# EAGLE design Audio_Power_Amplifier_LM386 (EAGLE 5.11)
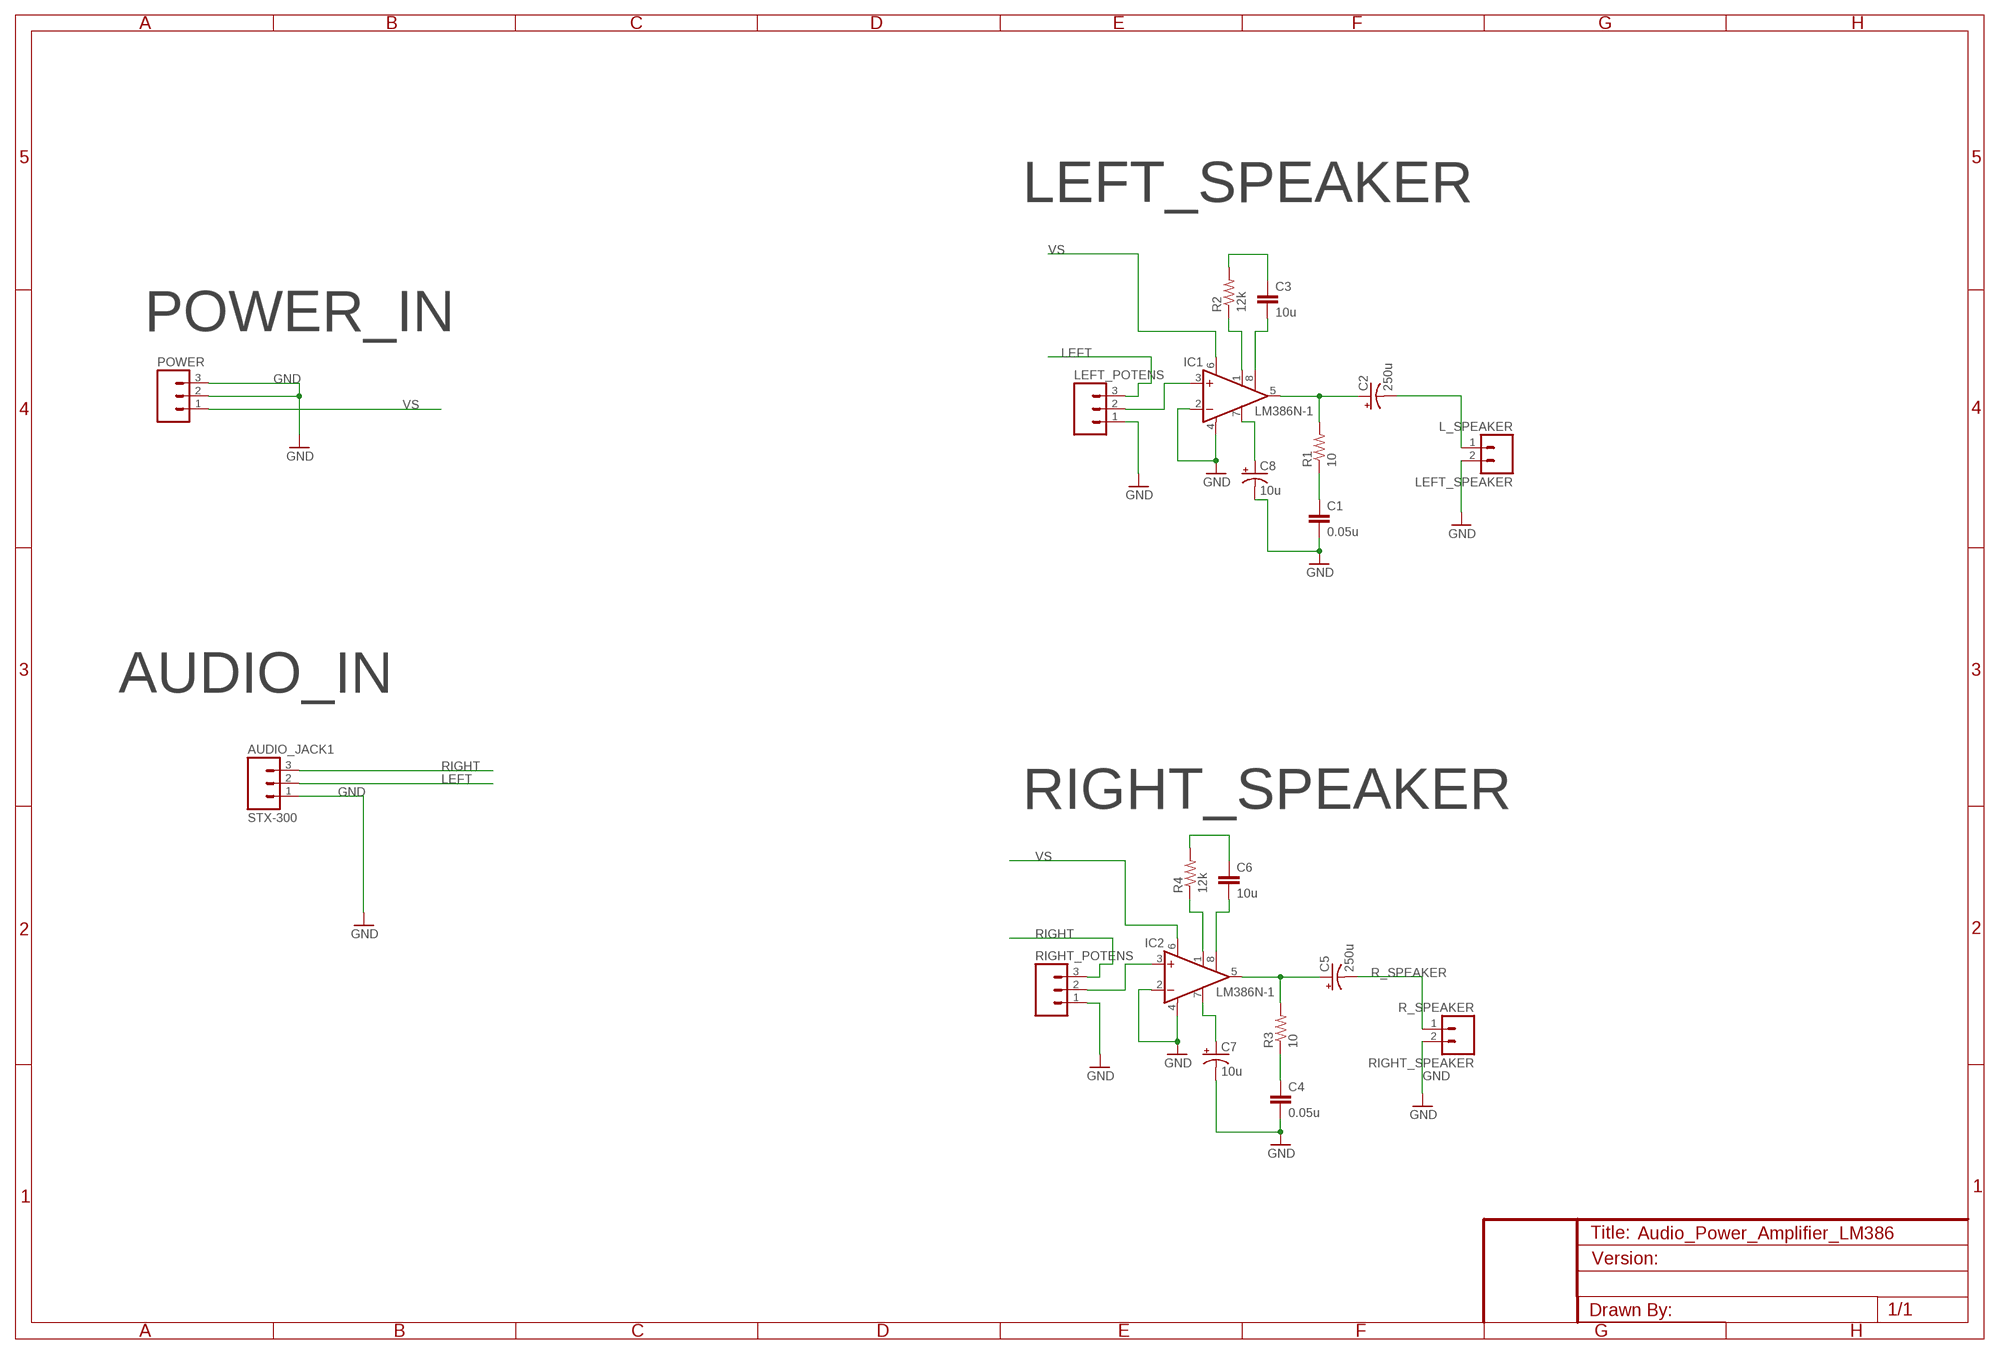
[diagram p0: schematic, sheet 1]

## Parts
AUDIO_JACK1  STX-300  M03PTH  [1X03]
C1  0.05u  CAPPTH2  [CAP-PTH-SMALL2]
C2  250u  CAP_POLPTH2  [CPOL-RADIAL-10UF-25V]
C3  10u  CAPPTH2  [CAP-PTH-SMALL2]
C4  0.05u  CAPPTH2  [CAP-PTH-SMALL2]
C5  250u  CAP_POLPTH2  [CPOL-RADIAL-10UF-25V]
C6  10u  CAPPTH2  [CAP-PTH-SMALL2]
C7  10u  CAP_POLPTH2  [CPOL-RADIAL-10UF-25V]
C8  10u  CAP_POLPTH2  [CPOL-RADIAL-10UF-25V]
IC1  LM386N-1  [DIL08]
IC2  LM386N-1  [DIL08]
LEFT_POTENS  M03PTH  [1X03]
LEFT_SPEAKER  L_SPEAKER  M02LOCK  [1X02_LOCK]
POWER  M03PTH  [1X03]
R1  10  RESISTORPTH1  [AXIAL-0.3]
R2  12k  RESISTORPTH1  [AXIAL-0.3]
R3  10  RESISTORPTH1  [AXIAL-0.3]
R4  12k  RESISTORPTH1  [AXIAL-0.3]
RIGHT_POTENS  M03PTH  [1X03]
RIGHT_SPEAKER  R_SPEAKER  M02LOCK  [1X02_LOCK]

## Nets
GND [net_GND]: AUDIO_JACK1.1 C1.2 C4.2 C7.2(-) C8.2(-) IC1.2(-IN) IC1.4(GND) IC2.2(-IN) IC2.4(GND) LEFT_POTENS.1 LEFT_SPEAKER.2 POWER.2 POWER.3 RIGHT_POTENS.1 RIGHT_SPEAKER.2
L_SPEAKER: C2.2(-) LEFT_SPEAKER.1
LEFT: AUDIO_JACK1.2 LEFT_POTENS.3
N$1: C2.1(+) IC1.5(OUT) R1.P$2
N$2: C1.1 R1.P$1
N$3: C8.1(+) IC1.7(BYPASS)
N$4: IC1.3(+IN) LEFT_POTENS.2
N$5: C7.1(+) IC2.7(BYPASS)
N$6: IC1.1(GAIN) R2.P$1
N$7: C3.1 R2.P$2
N$8: C3.2 IC1.8(GAIN)
N$9: C5.1(+) IC2.5(OUT) R3.P$2
N$10: C4.1 R3.P$1
N$12: IC2.3(+IN) RIGHT_POTENS.2
N$14: IC2.1(GAIN) R4.P$1
N$15: C6.1 R4.P$2
N$16: C6.2 IC2.8(GAIN)
R_SPEAKER: C5.2(-) RIGHT_SPEAKER.1
RIGHT: AUDIO_JACK1.3 RIGHT_POTENS.3
VS [net_VS]: IC1.6(VS) IC2.6(VS) POWER.1

## Notes on the sheet
- LEFT_SPEAKER
- POWER_IN
- AUDIO_IN
- RIGHT_SPEAKER

## Library data of the parts
AUDIO_JACK1 LEFT_POTENS POWER RIGHT_POTENS = SparkFun:M03: Header 3 Standard 3-pin 0.1" header. Use with straight break away headers (SKU : PRT-00116), right angle break away headers (PRT-00553), swiss pins (PRT-00743), machine pins (PRT-00117), and female headers (PRT-00115). Molex polarized connector foot print use with SKU : PRT-08232 with associated crimp pins and housings.
C1 C3 C4 C6 = SparkFun:CAP: Capacitor Standard 0603 ceramic capacitor, and 0.1" leaded capacitor.
C2 C5 C7 C8 = SparkFun:CAP_POL: Capacitor Polarized These are standard SMD and PTH capacitors. Normally 10uF, 47uF, and 100uF in electrolytic and tantalum varieties. Always verify the external diameter of the through hole cap, it varies with capacity, voltage, and manufacturer. The EIA devices should be standard.
IC1 IC2 = linear:LM386?-*: Low Voltage Audio Power Amplifier Source: http://cache.national.com/ds/LM/LM386.pdf
LEFT_SPEAKER RIGHT_SPEAKER = SparkFun:M02: Header 2 Standard 2-pin 0.1" header. Use with straight break away headers (SKU : PRT-00116), right angle break away headers (PRT-00553), swiss pins (PRT-00743), machine pins (PRT-00117), and female headers (PRT-00115). Molex polarized connector foot print use with SKU : PRT-08233 with associated crimp pins and housings.
R1-R4 = SparkFun:RESISTOR: Resistor Basic schematic elements and footprints for 0603, 1206, and PTH 1/10th watt (small) resistors.

## Net classes
0 net_DATA: width 0.254 mm, drill 0.254 mm, clearance 0.254 mm
1 net_GND: width 0.635 mm, drill 0.508 mm
2 net_VS: width 0.813 mm, drill 0.813 mm, clearance 0.254 mm

## Board
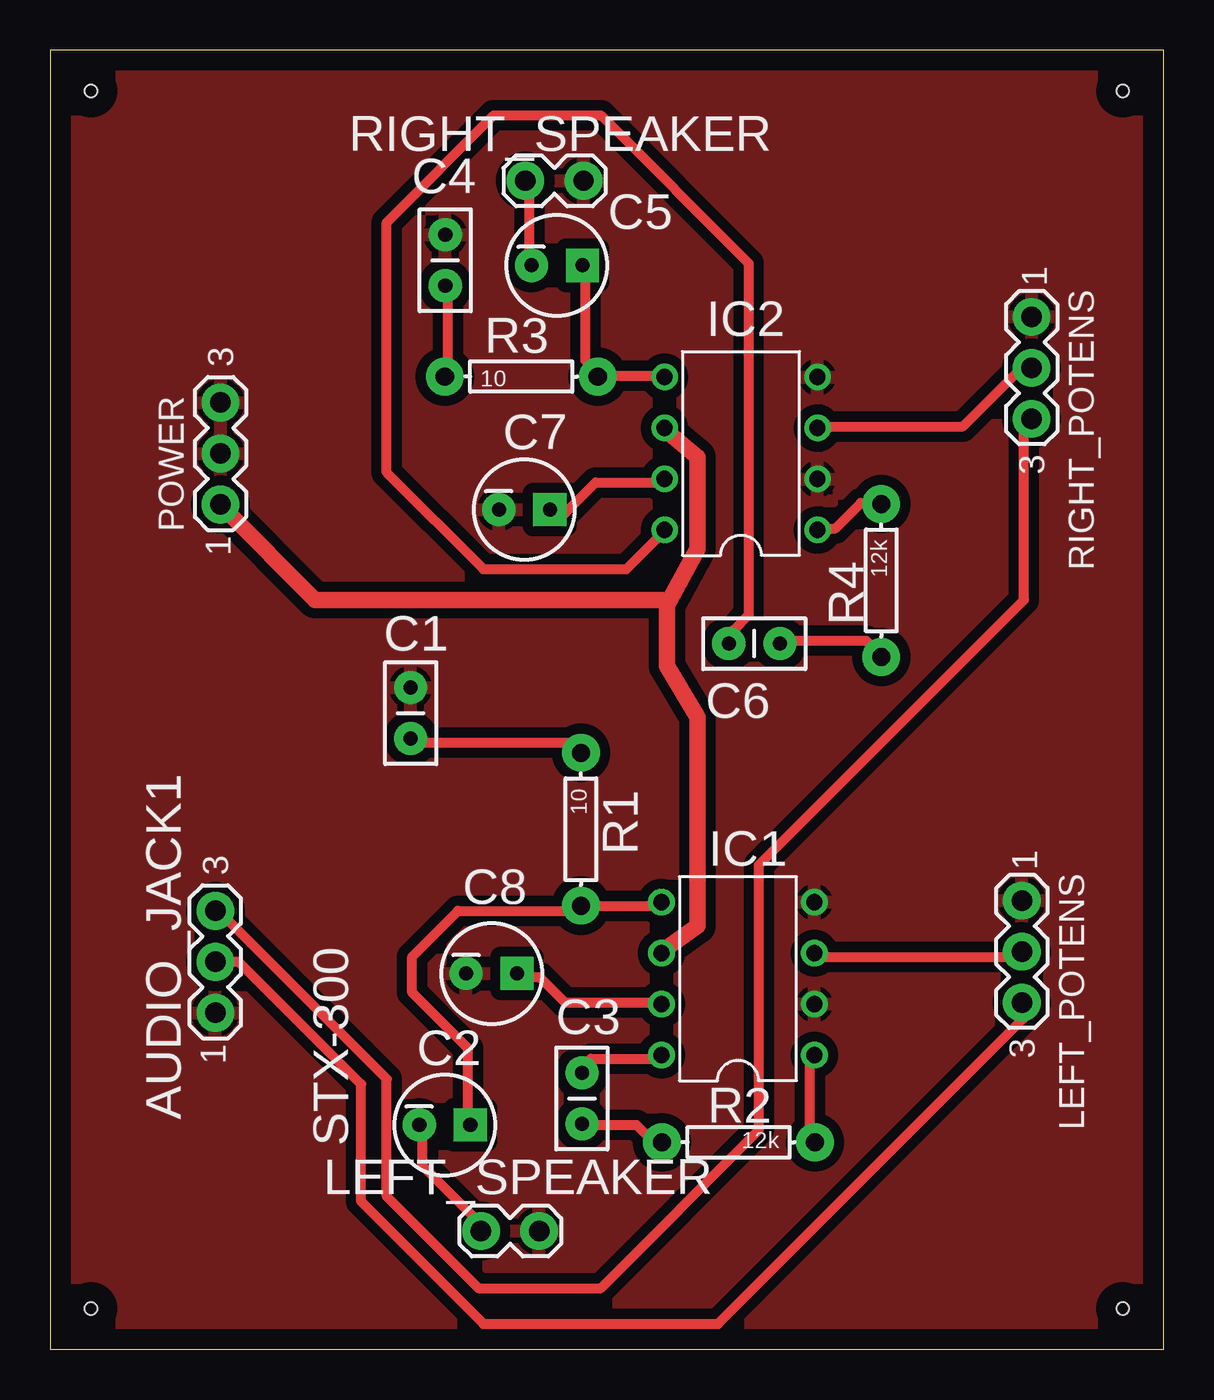
[diagram p1: board, top side]

Size 55.47 x 64.72 mm. Coordinates in mm from the lower left corner, seen from the top.
Outline: 0,0 55.47,0 55.47,64.72 0,64.72 0,0
Copper layers (1*16): Top 0.035mm / dielectric 1.5mm / Bottom 0.035mm
Design rules "my_handmade *": minimum track width 20mil, minimum drill 24mil, track to track 20mil, track to pad 20mil, pad to pad 20mil, via to via 20mil, smd to smd 20mil, copper to edge 40mil, drill to drill 8mil, minimum pad ring 10mil, minimum via ring 8mil, stop-mask expansion 4mil, vias tented up to drill 0mil, thermal gap 10mil
Holes 0.6 mm at 2.03,62.69 53.44,62.69 53.44,2.03 2.03,2.03

### Footprints (pad centres in the part's own frame; a part is rotated, then mirrored left to right if it is on the bottom)
1X03 = drill 1.016 pad 1.88 round: 1 0,0; 2 2.54,0; 3 5.08,0
CAP-PTH-SMALL2 = drill 0.7 pad 1.651 round: 1 0,0; 2 2.54,0
CPOL-RADIAL-10UF-25V = drill 0.7 pad 1.651 square: 1 1.27,0 | drill 0.7 pad 1.651 round: 2 -1.27,0
DIL08 = drill 0.813 pad 1.27 round: 1 -3.81,-3.81; 2 -1.27,-3.81; 3 1.27,-3.81; 4 3.81,-3.81; 5 3.81,3.81; 6 1.27,3.81; 7 -1.27,3.81; 8 -3.81,3.81
1X02_LOCK = drill 1.016 pad 1.88 round: 1 -0.178,0; 2 2.718,0
AXIAL-0.3 = drill 0.9 pad 1.88 round: P$1 -3.81,0; P$2 3.81,0

### Placement (x,y rotation side)
AUDIO_JACK1  8.23,16.76 90 top
C1  17.96,30.43 90 top
C2  19.66,11.18 0 top
C3  26.49,11.23 90 top
C4  19.68,52.98 90 top
C5  25.25,54 0 top
C6  36.35,35.15 180 top
C7  23.62,41.83 0 top
C8  22,18.72 0 top
IC1  34.26,18.47 90 top
IC2  34.42,44.63 90 top
LEFT_POTENS  48.41,22.35 270 top
LEFT_SPEAKER  21.64,5.89 0 top
POWER  8.48,42.09 90 top
R1  26.44,25.91 270 top
R2  34.29,10.31 180 top
R3  23.47,48.46 0 top
R4  41.4,38.3 270 top
RIGHT_POTENS  48.9,51.44 270 top
RIGHT_SPEAKER  23.85,58.22 0 top

### Tracks (layer width: path | path; a pad name or v marks a point on that pad's centre or on a via)
GND
  pour Top: 0,64.72 55.47,64.72 55.47,0 0,0
L_SPEAKER
  Top 0.508: C2.2 18.54,11.18 18.54,9.14 21.59,6.1 LEFT_SPEAKER.1
LEFT
  Top 0.508: AUDIO_JACK1.2 9.4,19.3 15.49,13.21 15.49,7.37 21.59,1.27 33.27,1.27 48.51,16.51 48.51,17.27 LEFT_POTENS.3
N$1
  Top 0.508: IC1.5 30.23,22.1 R1.P$2 26.42,22.1 26.16,21.84 20.32,21.84 18.03,19.56 18.03,17.78 20.83,14.99 20.83,11.18 C2.1
N$2
  Top 0.508: C1.1 18.03,30.23 25.91,30.23 26.42,29.72 R1.P$1
N$3
  Top 0.508: IC1.7 30.23,17.27 25.65,17.27 24.38,18.54 23.37,18.54 C8.1
N$4
  Top 0.508: IC1.3 38.1,19.56 48.01,19.56 48.26,19.81 LEFT_POTENS.2
N$5
  Top 0.508: IC2.7 30.48,43.18 27.18,43.18 25.65,41.66 24.89,41.66 C7.1
N$6
  Top 0.508: IC1.1 37.85,14.48 37.85,10.67 38.1,10.41 R2.P$1
N$7
  Top 0.508: C3.1 26.67,11.18 29.21,11.18 29.97,10.41 30.48,10.41 R2.P$2
N$8
  Top 0.508: IC1.8 30.23,14.48 26.92,14.48 26.42,13.97 C3.2
N$9
  Top 0.508: 27.43,48.51 30.48,48.51 IC2.5 | 27.43,48.51 26.67,49.28 26.67,53.85 C5.1 | R3.P$2 27.43,48.51
N$10
  Top 0.508: C4.1 19.81,52.83 19.81,48.51 R3.P$1
N$12
  Top 0.508: IC2.3 38.35,45.97 45.47,45.97 48.26,48.77 48.77,48.77 RIGHT_POTENS.2
N$14
  Top 0.508: IC2.1 38.35,40.89 39.12,40.89 40.39,42.16 41.4,42.16 R4.P$1
N$15
  Top 0.508: C6.1 36.58,35.31 40.64,35.31 41.4,34.54 R4.P$2
N$16
  Top 0.508: IC2.8 30.48,40.64 28.7,38.86 21.59,38.86 16.76,43.69 16.76,56.13 22.1,61.47 27.43,61.47 34.8,54.1 34.8,36.58 34.04,35.81 34.04,35.31 C6.2
R_SPEAKER
  Top 0.508: C5.2 23.88,54.1 23.88,58.42 RIGHT_SPEAKER.1
RIGHT
  Top 0.508: AUDIO_JACK1.3 8.38,21.84 16.76,13.46 16.76,7.62 21.34,3.05 27.43,3.05 35.31,10.92 35.31,24.13 48.51,37.34 48.51,45.97 RIGHT_POTENS.3
VS
  Top 0.813: 30.73,37.08 30.73,34.04 32.26,31.5 32.26,21.08 30.48,19.81 IC1.6 | 30.73,37.08 32.26,39.88 32.26,44.45 30.73,45.72 IC2.6 | POWER.1 8.64,41.91 13.21,37.34 30.48,37.34 30.73,37.08